# EAGLE design lux (EAGLE 7.7.0)
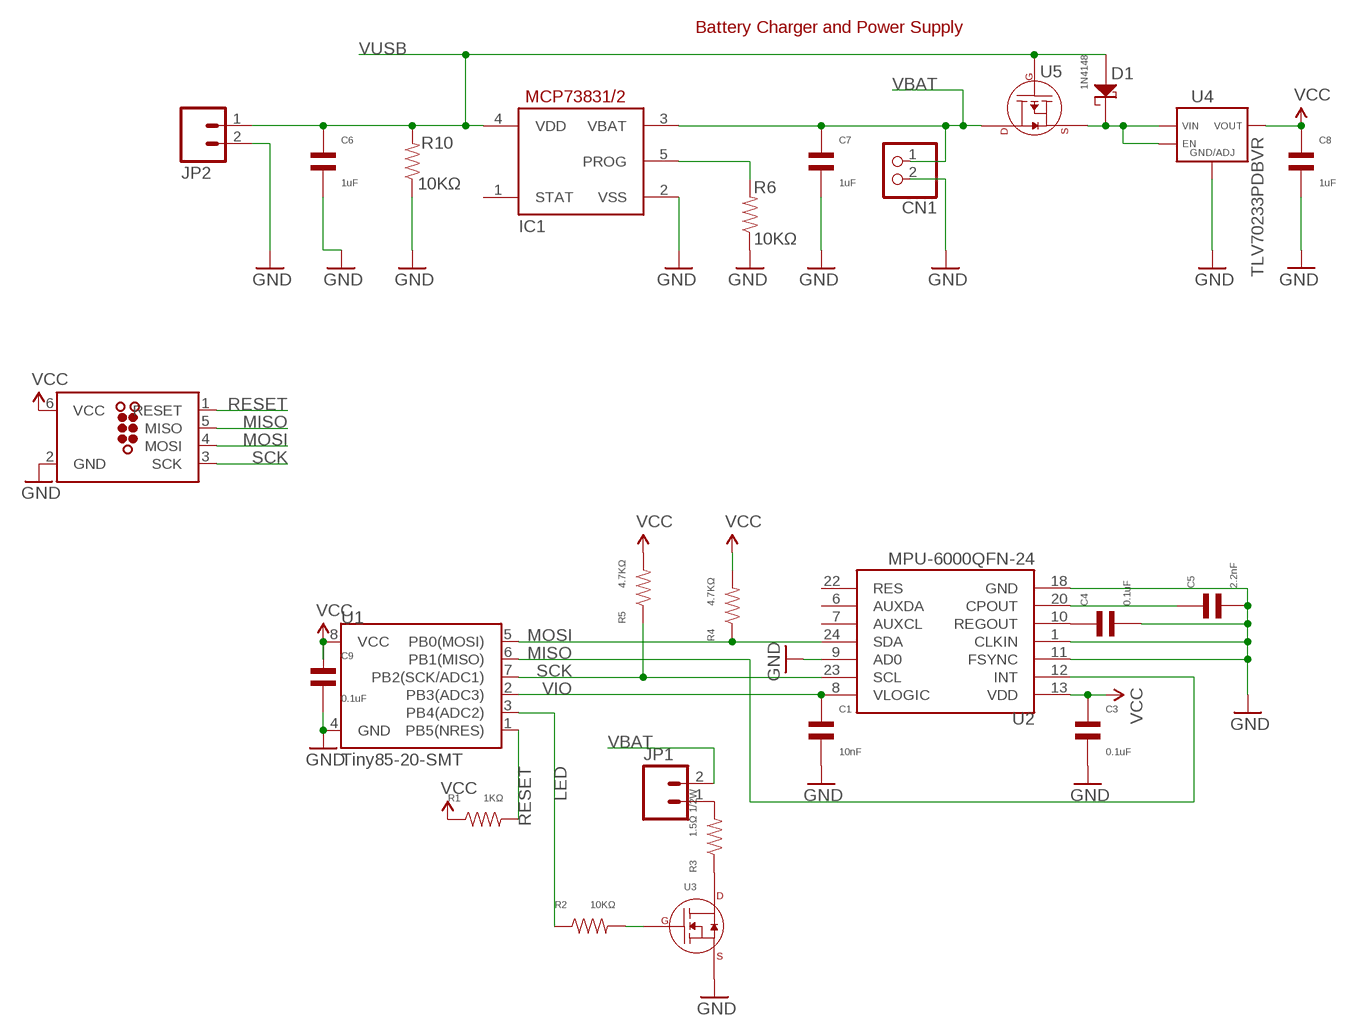
[diagram p0: schematic, sheet 1]

## Parts
C1  10nF  CAPACITOR_NP_0805  [C0805]
C3  0.1uF  CAPACITOR_NP_0805  [C0805]
C4  0.1uF  CAPACITOR_NP_0805  [C0805]
C5  2.2nF  CAPACITOR_NP_0805  [C0805]
C6  1uF  CAPACITOR_NP_0805  [C0805]
C7  1uF  CAPACITOR_NP_0805  [C0805]
C8  1uF  CAPACITOR_NP_0805  [C0805]
C9  0.1uF  CAPACITOR_NP_0805  [C0805]
CN1  JST_2PIN-SMT-RA  [JST-PH-2-SMT-RA]
D1  1N4148  DIODE_SOD-123  [SOD-123]
IC1  MCP73831/OT  [SOT23-5L]
J1  TC2030-MCP-NLFIX  [TC2030-MCP-NL]
JP1  M02PTH  [1X02]
JP2  M02PTH  [1X02]
R1  1KΩ  RESISTOR_0805  [R0805]
R2  10KΩ  RESISTOR_0805  [R0805]
R3  1.5Ω 1/2W  RESISTOR_0805  [R0805]
R4  4.7KΩ  RESISTOR_0805  [R0805]
R5  4.7KΩ  RESISTOR_0805  [R0805]
R6  10KΩ  RESISTOR_0805  [R0805]
R10  10KΩ  RESISTOR_0805  [R0805]
U1  Tiny85-20-SMT  ATTINY45TINY85-20-SMT  [SO08-EIAJ]
U2  MPU-6000QFN-24  [QFN-24-TESTING]
U3  N-CHANNEL_FET_SOT-23-3  [SOT-23-3]
U4  TLV70233PDBVR  [SOT-23-5]
U5  P-CHANNEL_FET_SOT-23-3  [SOT-23-3]

## Nets
GND [power]: C1.P$2 C3.P$2 C4.P$2 C5.P$2 C6.P$2 C7.P$2 C8.P$2 C9.P$2 CN1.2 IC1.2(VSS) J1.2(GND) JP2.2 R6.P$1 R10.P$1 U1.4(GND) U2.1(CLKIN) U2.9(AD0) U2.11(FSYNC) U2.18(GND) U3.P$2(SOURCE) U4.P$2(GND/ADJ)
LED: R2.P$1 U1.3(PB4(ADC2))
MISO: J1.5(MISO) U1.6(PB1(MISO)) U2.12(INT)
MOSI: J1.4(MOSI) R4.P$1 U1.5(PB0(MOSI)) U2.24(SDA)
N$3: R3.P$1 U3.P$3(DRAIN)
N$4: R2.P$2 U3.P$1(GATE)
N$10: C4.P$1 U2.10(REGOUT)
N$11: JP1.1 R3.P$2
N$13: C5.P$1 U2.20(CPOUT)
N$15: IC1.5(PROG) R6.P$2
RESET: J1.1(RESET) R1.P$2 U1.1(PB5(NRES))
SCK: J1.3(SCK) R5.P$1 U1.7(PB2(SCK/ADC1)) U2.23(SCL)
UC_VCC [power]: D1.CATHODE U4.P$1(VIN) U4.P$3(EN) U5.P$2(SOURCE)
VBAT [power]: C7.P$1 CN1.1 IC1.3(VBAT) JP1.2 U5.P$3(DRAIN)
VCC [power]: C3.P$1 C8.P$1 C9.P$1 J1.6(VCC) R1.P$1 R4.P$2 R5.P$2 U1.8(VCC) U2.13(VDD) U4.P$5(VOUT)
VIO [power]: C1.P$1 U1.2(PB3(ADC3)) U2.8(VLOGIC)
VUSB [power]: C6.P$1 D1.ANODE IC1.4(VDD) JP2.1 R10.P$2 U5.P$1(GATE)
Unconnected: IC1.1(STAT) U2.6(AUXDA) U2.7(AUXCL) U2.22(RES)

## Notes on the sheet
- Battery Charger and Power Supply

## Library data of the parts
C1 C3-C9 = MF_Passives:CAPACITOR_NP: Library: MF_Passives Description: Device for Non-Polarized Capacitors. Manufacture part number (MFG#), Voltage, Temperature Coefficient, and Tolerance can be added via Attributes.; MFG#: N/A; TEMP_COF: N/A; TOLERANCE: N/A; VOLTAGE: N/A
CN1 = adafruit:JST_2PIN: JST 2-Pin Connectors of various flavors SMT-RA (S2B-PH-SM4) 4UConnector #17311 SMT (B2B-PH-SM4) THM-RA (S2B-PH) THM (B2B-PH)
D1 = MF_Discrete_Semiconductor:DIODE: Library: MF_Discrete_Semiconductor Description: Device for Single Packaged Diodes. Manufacture part number (MFG#) can be added via Attributes.; MFG#: N/A
IC1 = adafruit:MCP73831: MCP73831/2 Miniature Single-Cell, Fully Integrated Li-Ion, Li-Polymer Charge Management Controllers. Nice and small simple lipoly charge controller, with adjustable current and status output (LED) http://www.ladyada.net/library/pcb/eaglelibrary.html
J1 = sonik:TC2030: TAG-CONNECT ICSP Connector Manufacturer: Tag-Connect <http://www.tag-connect.com> Cable for easy In-Circuit Serial Programming. Designed for Microchip ICD2, suitable for many others. Two variants - one "with legs" (for hands-free fit on PCB) and another "without legs" for quick programming. PAD Description 1 MCLR/Vpp 2 Vdd 3 GND 4 PGD (ISPDAT) 5 PGC (ISPCLK) 6 nc (used for LVP) ©2009 ROFA.cz - modified and updated by Robert Darlington ‹rdarlington@gmail.com›
JP1 JP2 = SparkFun-Connectors:M02: Standard 2-pin 0.1" header. Use with - straight break away headers ( PRT-00116) - right angle break away headers (PRT-00553) - swiss pins (PRT-00743) - machine pins (PRT-00117) - female headers (PRT-00115) Molex polarized connector foot print use with: PRT-08233 with associated crimp pins and housings. 2.54_SCREWTERM for use with PRT-10571. 3.5mm Screw Terminal footprints for PRT-08084 5mm Screw Terminal footprints for use with PRT-08432
R1-R6 R10 = MF_Passives:RESISTOR: Library: MF_Passives Description: Device for Resistors. Manufacture part number (MFG#), Voltage, Tolerance, and Wattage Rating can be added via Attributes.; MFG#: N/A; TOLERANCE: N/A; VOLTAGE: N/A; WATTAGE: N/A
U1 = SparkFun-DigitalIC:ATTINY45: Atmel 8-pin 2/4/8kB flash uC; PROD_ID: IC-09092
U2 = SparkFun-Sensors:MPU-6000: MPU-6000 - I2C address is 0x68 with AD0 low and 0x69 with AD0 high.
U3 = MF_Discrete_Semiconductor:N-CHANNEL_FET: Library: MF_Discrete_Semiconductor Description: Device for Single N-Channel Mosfet. Manufacture part number (MFG#) can be added via Attributes.
U4 = MF_IC_Power:TLV702: Manufacturer Part #: TLV702 Manufacturer: Texas Instruments Description: LDO Voltage Regulators
U5 = MF_Discrete_Semiconductor:P-CHANNEL_FET: Library: MF_Discrete_Semiconductor Description: Device for Single P-Channel Mosfet. Manufacture part number (MFG#) can be added via Attributes.; MFG#: N/A

## Net classes
1 power: width 0.305 mm

## Board
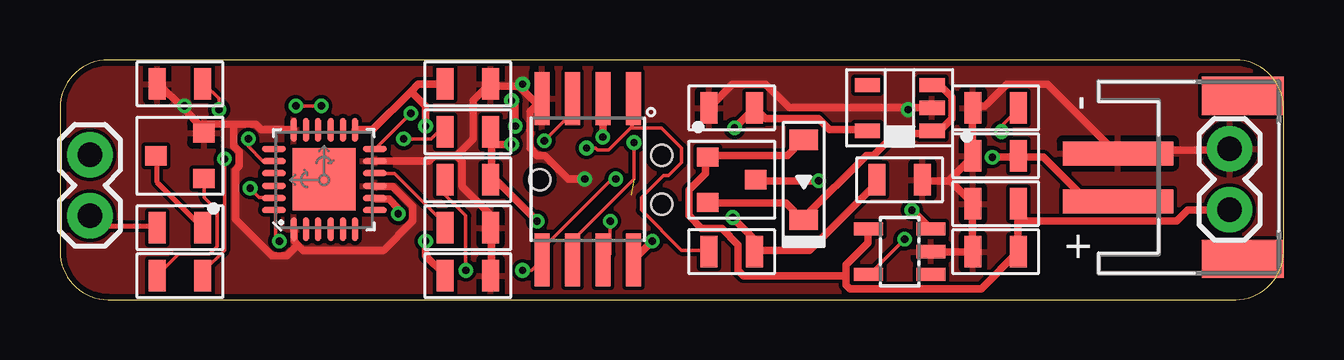
[diagram p1: board, top side]
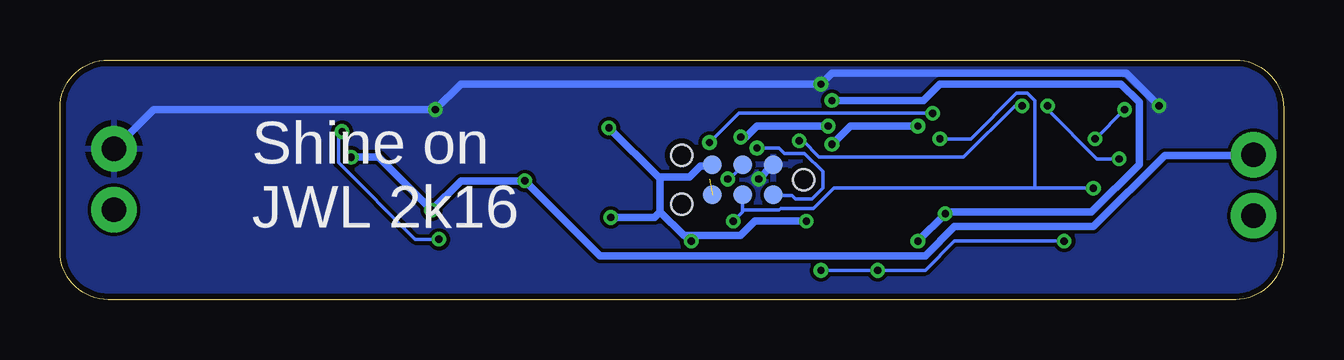
[diagram p2: board, bottom side, seen from below]

Size 51 x 10 mm. Coordinates in mm from the lower left corner, seen from the top.
Outline: 2,0 49,0 arc90 51,2 51,8 arc90 49,10 2,10 arc90 0,8 0,2 arc90 2,0
Copper layers (1*16): Top 0.035mm / dielectric 1.5mm / Bottom 0.035mm
Design rules "MF_Standard_2_Layer": minimum track width 6mil, minimum drill 12mil, track to track 6mil, track to pad 6mil, pad to pad 6mil, via to via 6mil, smd to smd 0mil, copper to edge 10mil, drill to drill 10mil, minimum pad ring 6mil, minimum via ring 6mil, stop-mask expansion 2mil, vias tented up to drill 25mil, thermal gap 10mil

### Footprints (pad centres in the part's own frame; a part is rotated, then mirrored left to right if it is on the bottom)
C0805 = smd 0.7 x 1.3: P$1 -0.95,0; P$2 0.95,0
JST-PH-2-SMT-RA = smd 1 x 4.6: 1 1,-3.7; 2 -1,-3.7 | smd 1.6 x 3.4: NC1 -3.4,1.5; NC2 3.4,1.5
SOD-123 = smd 0.85 x 1.2: ANODE 1.675,0; CATHODE -1.675,0
SOT23-5L = smd 0.55 x 1.2: 1 -0.95,-1.3; 2 0,-1.3; 3 0.95,-1.3; 4 0.95,1.3; 5 -0.95,1.3
TC2030-MCP-NL = smd 0.787 x 0.787: 1 4.73,-0.635; 2 4.73,0.635; 3 3.46,-0.635; 4 3.46,0.635; 5 2.19,-0.635; 6 2.19,0.635 | hole 0.889: 6,0; 0.92,-1.016; 0.92,1.016
1X02 = drill 1.016 pad 1.88: 1 0,0; 2 2.54,0
R0805 = smd 0.7 x 1.3: P$1 -0.95,0; P$2 0.95,0
SO08-EIAJ = smd 0.61 x 2.21: 1 -1.905,-3.378; 2 -0.635,-3.378; 3 0.635,-3.378; 4 1.905,-3.378; 5 1.905,3.353; 6 0.635,3.353; 7 -0.635,3.353; 8 -1.905,3.353
QFN-24-TESTING = smd 1.016 x 0.254: 1 -2.066,1.257; 2 -2.066,0.75; 3 -2.066,0.247; 4 -2.066,-0.287; 5 -2.066,-0.792; 6 -2.066,-1.297; 13 2.086,-1.297; 14 2.086,-0.792; 15 2.086,-0.287; 16 2.086,0.247; 17 2.086,0.75; 18 2.086,1.257 | smd 0.254 x 1.016: 7 -1.267,-2.122; 8 -0.762,-2.122; 9 -0.258,-2.122; 10 0.278,-2.122; 11 0.78,-2.122; 12 1.287,-2.122; 19 1.287,2.082; 20 0.78,2.082; 21 0.278,2.082; 22 -0.258,2.082; 23 -0.762,2.082; 24 -1.267,2.082 | smd 2.616 x 2.616: P$1 0.02,-0.01
SOT-23-3 = smd 0.8 x 0.9: P$1 -0.95,-1; P$2 0.95,-1; P$3 0,1
SOT-23-5 = smd 1.05 x 0.6: P$1 -1.35,0.95; P$2 -1.35,0; P$3 -1.35,-0.95; P$4 1.35,-0.95; P$5 1.35,0.95

### Placement (x,y rotation side)
C1  17,1 0 top
C3  17,9 0 top
C4  17,3 0 top
C5  5,9 180 top
C6  39,2 180 top
C7  39,6 180 top
C8  35,5 0 top
C9  28,8 180 top
CN1  47.8,5.1 270 top
D1  31,5 90 top
IC1  35,2 90 top
J1  26,5 0 bottom
JP1  1.25,3.5 90 top
JP2  48.75,3.75 90 top
R1  28,2 180 top
R2  5,1 180 top
R3  5,3 180 top
R4  17,5 0 top
R5  17,7 0 top
R6  39,8 0 top
R10  39,4 0 top
U1  22,5 180 top
U2  11,5 90 top
U3  5,6 90 top
U4  35,8 180 top
U5  28,5 270 top

### Tracks (layer width: path | path; a pad name or v marks a point on that pad's centre or on a via)
GND  (via drill 0.3)
  Top 0.305: 9.91,2.29 10.13,2.06 13.49,2.06 14.71,3.28 14.71,3.89 13.87,4.72 13.18,4.72 U2.9 | 9.91,2.29 9.75,2.44 9.75,2.9 U2.1 | 5.11,8 4.12,8.99 C5.P$2 | 5.11,8 5.94,7.16 5.94,7.01 U3.P$2 5.94,7.32 7.24,7.32 | 7.24,7.32 8.15,7.32 8.38,7.09 9.68,7.09 U2.18 | 9.91,2.29 9.45,1.83 8.84,1.83 7.32,3.35 7.32,5.41 7.47,5.56 7.47,6.17 7.24,6.4 7.24,7.32 | v21.87,5.03 21.18,5.03 20.19,6.02 19.89,6.02 19.58,6.33 19.58,7.85 20.04,8.31 U1.4 19.81,8.23 19.2,8.84 | C1.P$2 17.98,1.07 17.98,2.97 C4.P$2 17.91,3.12 17.91,3.58 16.76,4.72 16.76,5.79 16.54,6.02 | 16.54,6.02 15.62,6.02 15.39,5.79 13.18,5.79 U2.11 | 16.54,6.02 17.22,6.71 17.22,8.31 17.91,8.99 C3.P$2 18.06,8.91 19.13,8.91 19.2,8.84 | 35.36,8 30.4,8 29.41,8.99 28.04,8.99 C9.P$2 | 35.36,8 U4.P$2 | IC1.2 36.35,1.98 38.02,1.98 C6.P$2 38.02,2.13 38.02,3.96 R10.P$1 37.95,4.12 37.11,4.95 | 37.11,4.95 35.97,4.95 C8.P$2 | 37.11,4.95 37.11,5.03 38.02,5.94 C7.P$2 38.02,6.1 38.02,7.92 R6.P$1 38.18,8.08 38.56,8.08 39.47,8.99 41.15,8.99 43.97,6.17 CN1.2 44.12,6.17 44.2,6.25 48.69,6.25 JP2.2 | v35.36,7.92 35.36,8 | v19.28,8.99 19.28,8.91 19.2,8.84 | v5.18,8.08 5.11,8
  Bottom 0.305: v21.87,5.03 21.34,5.56 J1.2 | JP2.2 48.69,6.33 47.09,7.92 v35.36,7.92 34.29,8.99 v19.28,8.99 18.82,9.45 6.55,9.45 v5.18,8.08
  pour Top: 0,0 51,0 51,10 0,10
  pour Bottom: 0,0 51,0 51,10 0,10
LED  (via drill 0.3)
  Top 0.152: v6.86,5.87 6.86,2.06 6.02,1.22 6.02,1.07 R2.P$1 | v10.9,8.08 v9.83,8.08 | v20.19,6.63 21.34,7.77 21.34,8.31 U1.3
  Bottom 0.152: v6.86,5.87 7.77,5.87 9.83,7.92 v9.83,8.08 | v10.9,8.08 11.2,8.08 13.34,5.94 19.36,5.94 20.04,6.63 v20.19,6.63
MISO  (via drill 0.3)  (1 unrouted)
  Top 0.152: v14.63,7.77 13.18,6.33 U2.12 | v23.93,6.55 23.93,5.03 21.41,2.52 21.41,1.68 U1.6
  Bottom 0.152: v14.63,7.77 22.71,7.77 v23.93,6.55
MOSI  (via drill 0.3)
  Top 0.152: v23.16,5.03 23.01,5.03 20.12,2.13 20.12,1.68 U1.5 20.04,1.6 19.66,1.22 v19.28,1.22 | v9.14,2.44 8.99,2.59 8.99,3.66 U2.24 | v16.92,1.22 16.92,3.5 16.08,4.34 16.08,4.95 R4.P$1
  Bottom 0.152: v23.16,5.03 23.09,5.03 22.55,5.56 J1.4 | v9.14,2.44 13.72,2.44 14.94,1.22 v16.92,1.22 v19.28,1.22
N$3
  Top 0.152: 4.04,5.94 U3.P$3 | 5.94,3.05 R3.P$1
  Top 0.203: 4.04,5.94 4.04,4.91 R3.P$1
N$4
  Top 0.152: U3.P$1 6.02,5.03 6.02,4.27 6.55,3.73 6.55,2.21 6.25,1.91 4.95,1.91 4.12,1.07 R2.P$2
N$10
  Top 0.152: U2.10 13.18,5.26 13.95,5.26 16,3.2 16,3.05 C4.P$1
N$11
  Top 0.152: 4.04,3.05 R3.P$2 | 1.29,3.43 JP1.1
  Top 0.203: 4.04,3.05 1.25,3.05 JP1.1
N$13  (via drill 0.3)
  Top 0.152: v7.85,6.71 7.85,6.4 8.46,5.79 8.91,5.79 U2.20 | v6.63,7.92 6.63,8.38 6.02,8.99 C5.P$1
  Bottom 0.152: v6.63,7.92 v7.85,6.71
N$15  (via drill 0.3)
  Top 0.152: v35.2,2.52 33.76,1.07 IC1.5 | v39.24,7.01 39.24,7.24 39.93,7.92 R6.P$2
  Bottom 0.152: v35.2,2.52 36.2,2.52 39.4,5.71 39.4,6.86 v39.24,7.01
RESET  (via drill 0.3)
  Top 0.152: v21.95,6.33 22.33,6.33 22.4,6.25 22.86,6.25 23.81,7.2 | 23.81,7.2 23.85,7.24 23.85,8.31 U1.1 | R1.P$2 26.98,2.06 25.91,2.06 24.23,3.73 24.23,4.27 25.15,5.18 25.38,5.18 25.91,5.71 25.91,6.33 25.07,7.16 23.85,7.16 23.81,7.2
  Bottom 0.152: v21.95,6.33 21.03,6.33 20.8,6.1 19.96,6.1 19.2,5.33 19.2,4.65 19.66,4.19 20.34,4.19 20.5,4.34 21.26,4.34 J1.1
SCK  (via drill 0.3)
  Top 0.152: v22.94,3.28 22.94,1.91 22.71,1.68 U1.7 | v7.92,4.65 8.31,4.27 8.91,4.27 U2.23 | v14.33,6.71 15.47,6.71 15.7,6.93 16,6.93 R5.P$1
  Bottom 0.152: 22.55,3.73 22.55,3.66 v22.94,3.28 | 22.55,3.73 22.55,4.34 J1.3 | 10.36,4.65 18.75,4.65 19.58,3.81 20.95,3.81 21.03,3.73 22.55,3.73 | 10.36,4.65 v7.92,4.65 | v14.33,6.71 13.03,6.71 11.12,8.61 10.67,8.61 10.36,8.31 10.36,4.65
UC_VCC
  Top 0.305: U4.P$3 36.42,8.91 36.73,8.91 37.19,8.46 37.19,7.54 36.73,7.09 36.42,7.09 U4.P$1 36.27,6.93 34.82,6.93 33.91,6.02 33.6,6.02 31.01,3.43 D1.CATHODE 30.94,3.35 30.25,4.04 27.05,4.04 U5.P$2
VBAT  (via drill 0.3)
  Top 0.305: CN1.1 44.04,4.12 42.82,4.12 41,5.94 40.01,5.94 C7.P$1 39.85,5.94 v38.86,5.94 | v31.62,4.95 29.03,4.95 U5.P$3 | v35.51,3.73 36.27,2.97 IC1.3
  Bottom 0.305: JP1.2 1.29,6.02 4.95,6.02 7.92,3.05 13.72,3.05 14.94,1.83 28.5,1.83 v31.62,4.95 34.29,4.95 v35.51,3.73 37.72,5.94 v38.86,5.94
VCC  (via drill 0.3)
  Top 0.305: C8.P$1 33.98,4.95 33.98,4.8 31.24,2.06 28.96,2.06 R1.P$1 28.96,2.21 28.96,2.52 v28.04,3.43 | 14.63,8.69 14.94,8.99 16,8.99 C3.P$1 | 14.63,8.69 13.03,7.09 12.34,7.09 U2.13 | v28.12,7.16 28.88,7.92 C9.P$1 29.03,7.92 29.41,7.54 31.62,7.54 32.08,7.09 33.6,7.09 U4.P$5 | v19.89,3.28 18.14,5.03 R4.P$2 17.98,5.03 17.98,6.93 R5.P$2 18.06,6.48 v18.82,6.48 | v24.69,2.44 23.93,1.68 U1.8 | 14.63,8.69 15.24,8.08 v15.24,7.24
  Bottom 0.305: 25.98,5.11 26.06,5.11 v28.12,7.16 | 25.98,5.11 24.77,5.11 24.31,5.56 23.85,5.56 J1.6 | v19.89,3.28 22.02,3.28 22.63,2.67 24.69,2.67 | 24.69,2.67 24.99,2.67 25.98,3.66 | 25.98,5.11 25.98,3.66 | 24.69,2.67 v24.69,2.44 | v15.24,7.24 18.06,7.24 v18.82,6.48 | v28.04,3.43 26.21,3.43 25.98,3.66
VIO  (via drill 0.3)
  Top 0.305: v14.1,3.58 14.1,3.81 13.72,4.19 13.18,4.19 U2.8 | v15.24,2.44 15.24,1.83 16,1.07 C1.P$1 | v22.63,6.78 22.63,8.31 U1.2 | v18.97,7.24 18.97,8.15 v18.82,8.31
  Bottom 0.305: v15.24,2.44 v14.1,3.58 14.02,3.66 8,3.66 6.02,5.64 6.02,8.23 6.78,8.99 14.33,8.99 15.01,8.31 v18.82,8.31 | v22.63,6.78 22.4,6.78 21.95,7.24 v18.97,7.24
VUSB
  Top 0.305: D1.ANODE 30.94,6.63 30.33,6.02 27.05,6.02 U5.P$1 26.9,5.87 26.9,5.26 26.21,4.57 26.21,3.5 26.75,2.97 27.58,2.97 28.27,2.29 28.27,1.22 28.5,0.99 32.77,0.99 | 32.77,0.99 32.77,0.61 32.92,0.46 38.41,0.46 39.93,1.98 C6.P$1 39.93,2.13 39.93,3.28 | 32.77,0.99 32.77,1.45 33.68,2.36 33.68,2.9 IC1.4 | 39.93,3.28 39.93,3.96 R10.P$2 | 39.93,3.28 46.56,3.28 47.02,3.73 48.69,3.73 JP2.1

### Text on the board
bNames: Shine on / JWL 2k16